# Altium schematic sheet micron_P6.SchDoc
size A; SheetNumber: 6; SheetTotal: 11
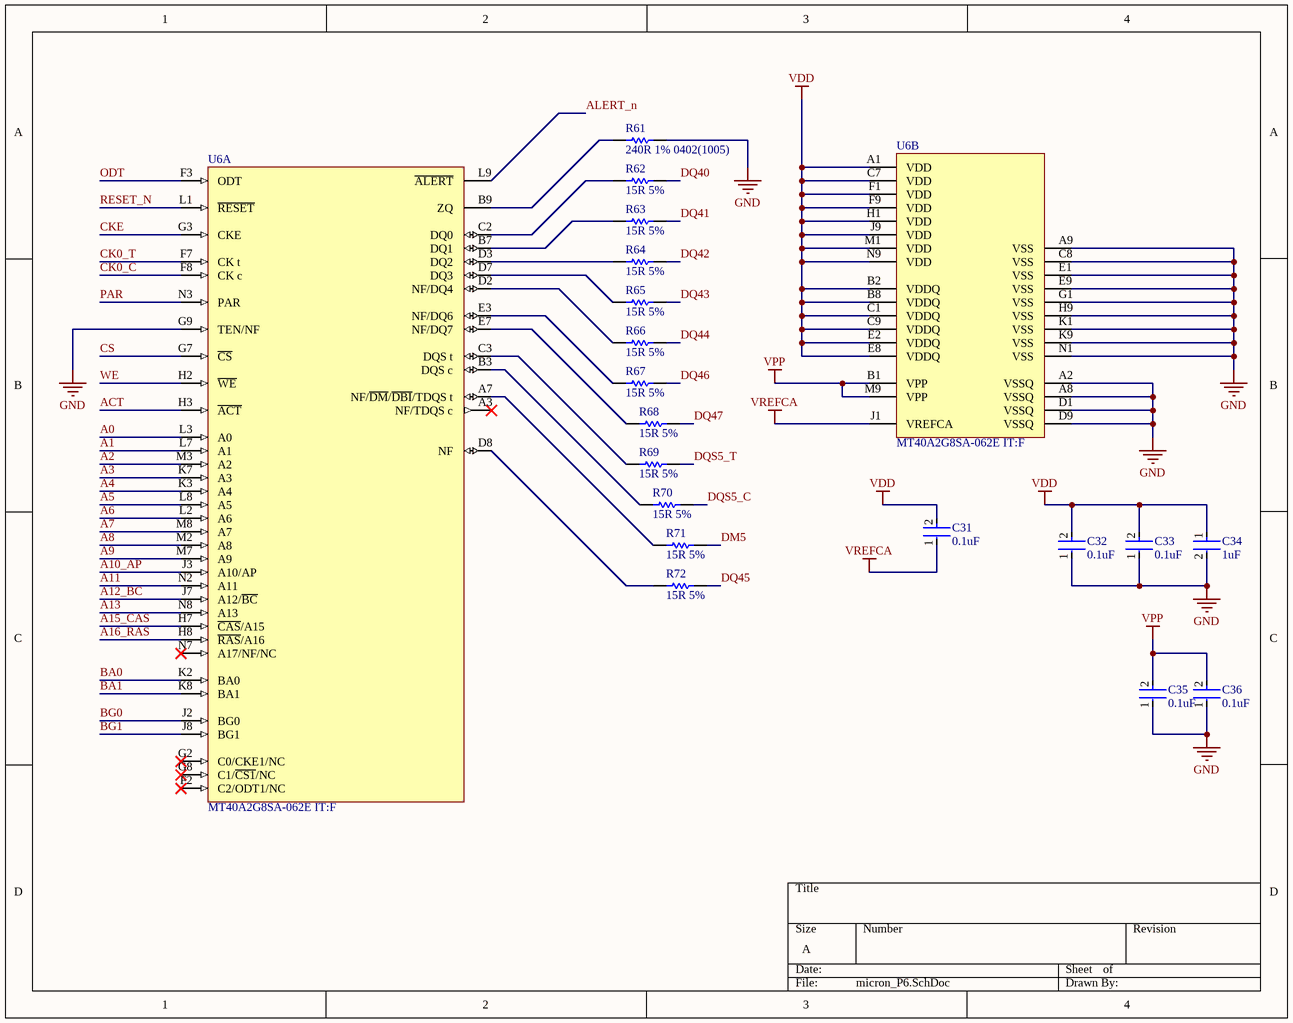
[diagram p0: micron_P6.SchDoc]

## Parts
C31  0.1uF  [FP-GRM15-MFG]
C32  0.1uF  [FP-GRM15-MFG]
C33  0.1uF  [FP-GRM15-MFG]
C34  1uF  [FP-CL511-IPC_C]
C35  0.1uF  [FP-GRM15-MFG]
C36  0.1uF  [FP-GRM15-MFG]
R61  240R 1% 0402(1005)  [RESC0402(1005)_L]
R62  15R 5%  [RESC1005X40X25LL05T10]
R63  15R 5%  [RESC1005X40X25LL05T10]
R64  15R 5%  [RESC1005X40X25LL05T10]
R65  15R 5%  [RESC1005X40X25LL05T10]
R66  15R 5%  [RESC1005X40X25LL05T10]
R67  15R 5%  [RESC1005X40X25LL05T10]
R68  15R 5%  [RESC1005X40X25LL05T10]
R69  15R 5%  [RESC1005X40X25LL05T10]
R70  15R 5%  [RESC1005X40X25LL05T10]
R71  15R 5%  [RESC1005X40X25LL05T10]
R72  15R 5%  [RESC1005X40X25LL05T10]
U6  MT40A2G8SA-062E IT:F  [SA_MFG]  (parts A,B of 2)

## Nets
GND: C32.1 C33.1 C34.2 C35.1 C36.1 R61.2 U6.A2(VSSQ) U6.A8(VSSQ) U6.A9(VSS) U6.C8(VSS) U6.D1(VSSQ) U6.D9(VSSQ) U6.E1(VSS) U6.E9(VSS) U6.G1(VSS) U6.G9(TEN/NF) U6.H9(VSS) U6.K1(VSS) U6.K9(VSS) U6.N1(VSS)
VDD: C31.2 C32.2 C33.2 C34.1 U6.A1(VDD) U6.B2(VDDQ) U6.B8(VDDQ) U6.C1(VDDQ) U6.C7(VDD) U6.C9(VDDQ) U6.E2(VDDQ) U6.E8(VDDQ) U6.F1(VDD) U6.F9(VDD) U6.H1(VDD) U6.J9(VDD) U6.M1(VDD) U6.N9(VDD)
VPP: C35.2 C36.2 U6.B1(VPP) U6.M9(VPP)
VREFCA: C31.1 U6.J1(VREFCA)
A0: U6.L3(A0)
A1: U6.L7(A1)
A2: U6.M3(A2)
A3: U6.K7(A3)
A4: U6.K3(A4)
A5: U6.L8(A5)
A6: U6.L2(A6)
A7: U6.M8(A7)
A8: U6.M2(A8)
A9: U6.M7(A9)
A10_AP: U6.J3(A10/AP)
A11: U6.N2(A11)
A12_BC: U6.J7(A12/~{BC})
A13: U6.N8(A13)
A15_CAS: U6.H7(~{CAS}/A15)
A16_RAS: U6.H8(~{RAS}/A16)
ACT: U6.H3(~{ACT})
ALERT_n: U6.L9(~{ALERT})
BA0: U6.K2(BA0)
BA1: U6.K8(BA1)
BG0: U6.J2(BG0)
BG1: U6.J8(BG1)
CK0_C: U6.F8(CK_c)
CK0_T: U6.F7(CK_t)
CKE: U6.G3(CKE)
CS: U6.G7(~{CS})
DM5: R71.2
DQ40: R62.2
DQ41: R63.2
DQ42: R64.2
DQ43: R65.2
DQ44: R66.2
DQ45: R72.2
DQ46: R67.2
DQ47: R68.2
DQS5_C: R70.2
DQS5_T: R69.2
ODT: U6.F3(ODT)
PAR: U6.N3(PAR)
RESET_N: U6.L1(~{RESET})
WE: U6.H2(~{WE})
NetR61_1: R61.1 U6.B9(ZQ)
NetR62_1: R62.1 U6.C2(DQ0)
NetR63_1: R63.1 U6.B7(DQ1)
NetR64_1: R64.1 U6.D3(DQ2)
NetR65_1: R65.1 U6.D7(DQ3)
NetR66_1: R66.1 U6.D2(NF/DQ4)
NetR67_1: R67.1 U6.E3(NF/DQ6)
NetR68_1: R68.1 U6.E7(NF/DQ7)
NetR69_1: R69.1 U6.C3(DQS_t)
NetR70_1: R70.1 U6.B3(DQS_c)
NetR71_1: R71.1 U6.A7(NF/~{DM}/~{DBI}/TDQS_t)
NetR72_1: R72.1 U6.D8(NF)

Not connected (* = marked no-connect by the designer): U6 A3(NF/TDQS_c)* F2(C2/ODT1/NC)* G2(C0/CKE1/NC)* G8(C1/~{CS1}/NC)* N7(A17/NF/NC)*

## Library data of the parts
C31-C33 C35 C36 = CMP-2100-03641-2: CAP CER 0.1UF 16V X7R 0402; Manufacturer Part Number: GRM155R71C104KA88D; Manufacturer: Murata; Standoff Height: 0mm; Tolerance: 10%; Voltage Rating: 16Vdc; Material: Ceramic; Capacitance: 0.10μF; Value: 0.10μF; RoHS: TRUE; Temperature Characteristic: X7R; Octopart: https://octopart.com/grm155r71c104ka88d-murata-196880; Digikey Description: CAP CER 0.1UF 16V X7R 0402; Device Class L3: Ceramic Capacitors; Height: 0.55mm; ComponentLink2Description: Datasheet; Temperature Range Low: -55°C; Ipc Land Pattern Name: CAPC10050X219; ComponentLink2URL: https://search.murata.co.jp/Ceramy/image/img/A01X/G101/ENG/GRM155R71H471KA01-01A.pdf; Device Class L1: Passive Components; Lead Free: yes; Category: Cap; Package: GRM15; Temperature: -55°C to +125°C; Device Class L2: Capacitors; Temperature Range High: +125°C; Mouser Description: 0402 0.1 uF 16V ±10 % Tolerance X7R SMT Multilayer Ceramic Capacitor
C34 = CMP-13271-001936-1: Cap Ceramic 1uF 10V X5R ±10% SMD 0402 +85°C Paper T/R; Depth: 0.5mm; Case Code (Imperial): 0402; Material: Ceramic; Mount: Surface Mount; Thickness: 0.022inch; Dielectric: X5R; Capacitance: 1uF; Radiation Hardening: No; Case/Package: 0402; Length: 1mm; Tolerance: 10%; Max Operating Temperature: 85°C; Package Quantity: 1; Width: 0.02inch; Voltage Rating: 10V; Contact Plating: Tin; Height: 0.5mm; Min Operating Temperature: -55°C; Case Code (Metric): 1005; Packaging: Tape and Reel
R61 = CMP-1011-00438-1: 240R 0.063W 1% 0402 (1005 Metric)  SMD; Case-Metric: 1005; Case-EIA: 0402; Value: 240.00 Ohm; Power: 0.063 W; Tolerance: 1 %; Technology: SMT
R62-R72 = CMP-2002-07413-1: Manufacturer: Yageo / Phycomp; Part Number: RC0402FR-0715RL
U6 = CMP-00526-125391410-1: DRAMChip DDR4 SDRAM 16Gbit 2Gx8 1.2V 78-Pin FBGA Tray; ComponentLink1URL: http://www.micron.com/; ComponentLink3Description: Manufacturer's Package Drawing; ComponentLink2Description: Datasheet URL; ComponentLink1Description: Manufacturer's Website; ComponentLink3URL: https://www.micron.com/content/dam/micron/global/public/products/customer-service-note/csn33-bga-user-guide.pdf; HelpURL: https://4donline.ihs.com/images/VipMasterIC/IC/MICT/MICT-S-A0014105731/MICT-S-A0014105731-1.pdf?hkey=6D3A4C79FDBF58556ACFDE234799DDF0; ComponentLink2URL: https://4donline.ihs.com/images/VipMasterIC/IC/MICT/MICT-S-A0014105731/MICT-S-A0014105731-1.pdf?hkey=6D3A4C79FDBF58556ACFDE234799DDF0